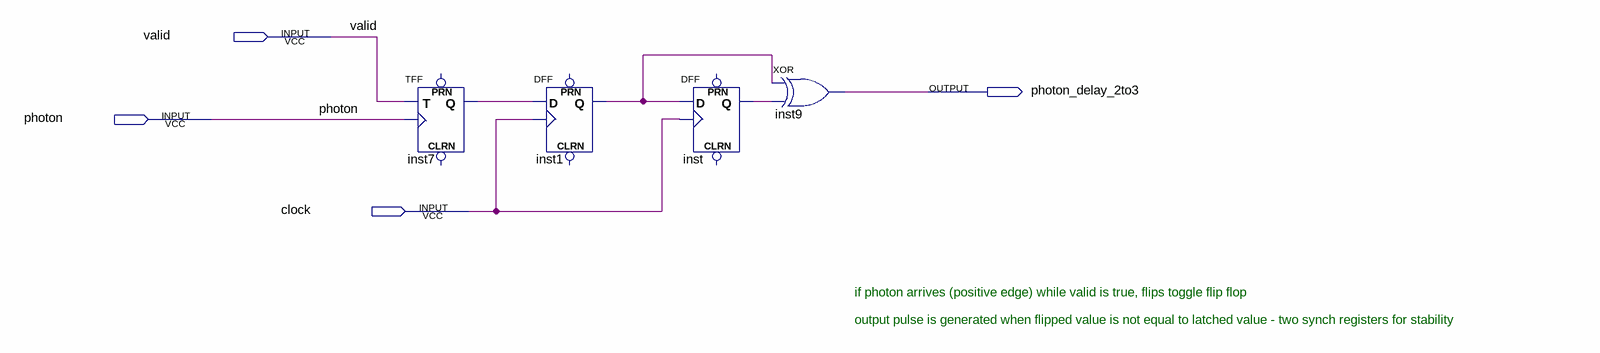
[diagram p0: schematic sheet]
// Quartus schematic edge_detect.bdf as structural Verilog: 4 symbols, 4 pins
module edge_detect (
  input  valid,
  input  photon,
  input  clock,
  output photon_delay_2to3
);

  wire inst1_q, inst7_q, inst_q;

  TFF inst7 (.T(valid), .CLK(photon), .Q(inst7_q));  // open: PRN, CLRN
  DFF inst1 (.CLK(clock), .D(inst7_q), .Q(inst1_q));  // open: CLRN, PRN
  DFF inst (.CLK(clock), .D(inst1_q), .Q(inst_q));  // open: CLRN, PRN
  xor inst9 (photon_delay_2to3, inst1_q, inst_q);

  // Notes on the sheet:
  //   if photon arrives (positive edge) while valid is true, flips toggle flip flop
  //   output pulse is generated when flipped value is not equal to latched value - two synch registers for stability
endmodule
